# Altium project Carte_IPAv.PrjPcb
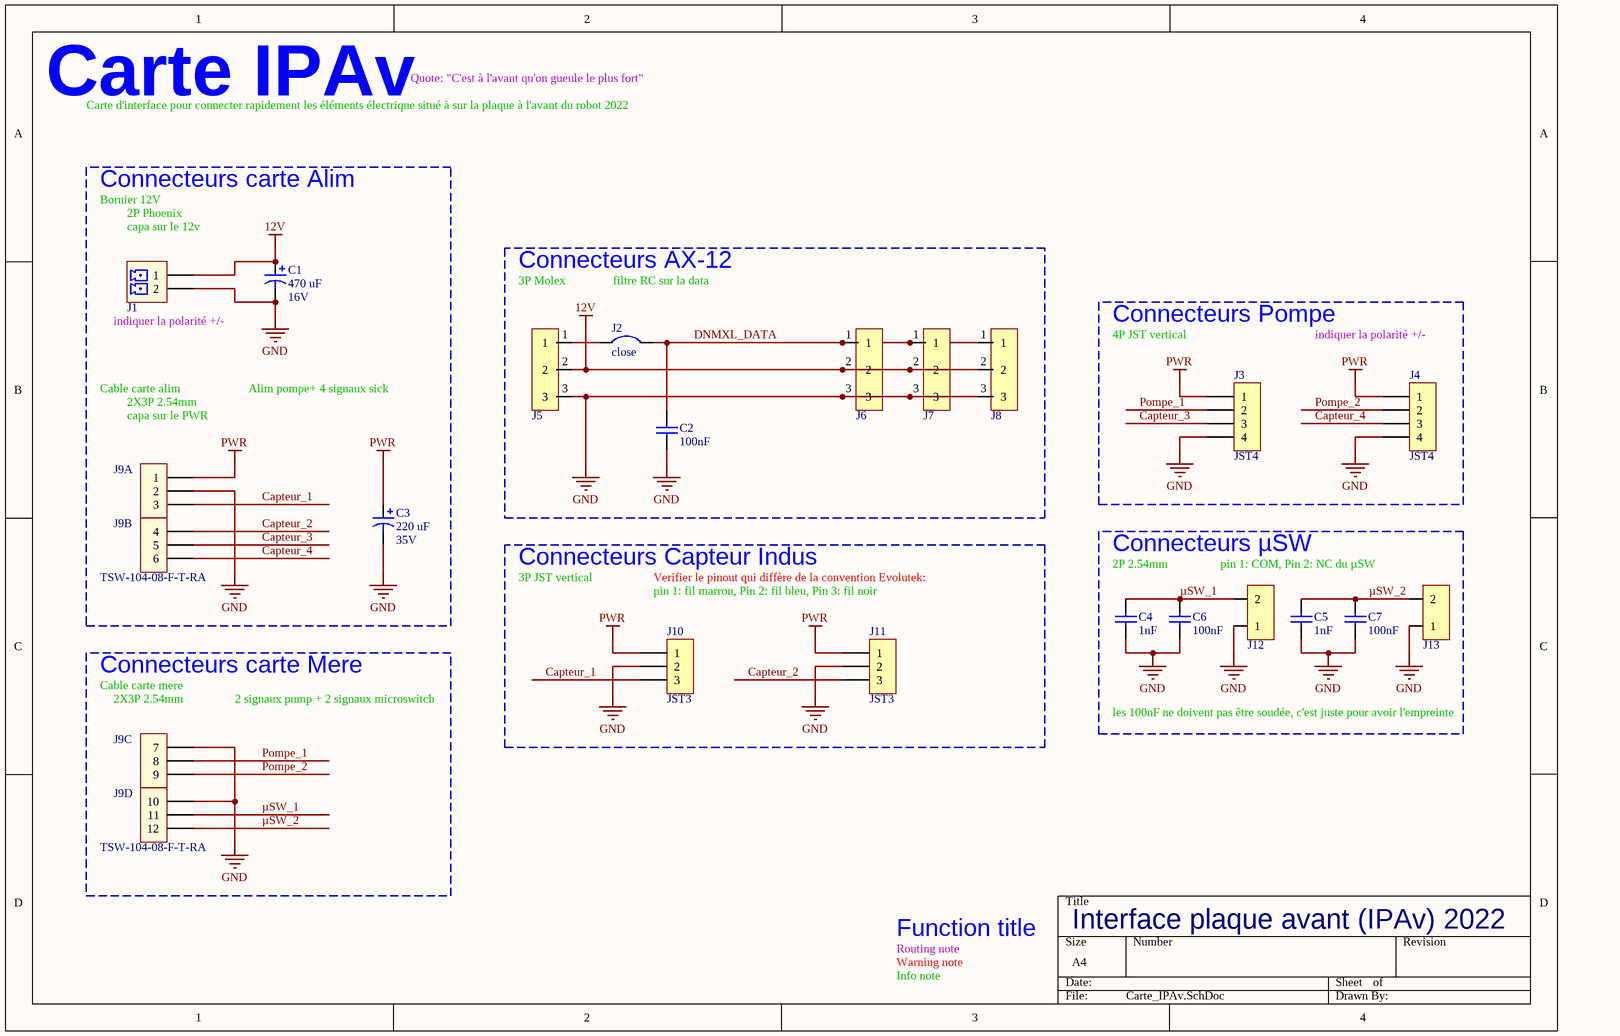
[diagram p0: Carte_IPAv.SchDoc]
1 sheet, 20 parts. Net scope: global (net labels, ports and power ports of the same name join across sheets).
Board file: Carte_IPAv.PcbDoc

## Sheet Carte_IPAv.SchDoc
size A4; Author: Audran; CompanyName: Goldorak; Address1: Electrolab; Address2: 52 rue Paul Lescop; Address3: 92000 Nanterre; DocumentNumber: 1; SheetNumber: 1; SheetTotal: 5; ProjectName: Cartes_2017

### Parts
C1  470 uF  RatedVoltage: 16V  [WCAP-ATG8_8x11.5x3.5x0.5]
C2  100nF  [WCAP-CSGP_0603, 1.6x0.8x0.8]
C3  220 uF  RatedVoltage: 35V  [WCAP-ATG8_8x11.5x3.5x0.5]
C4  1nF  [WCAP-CSGP_0402, 1x0.5x0.5]
C5  1nF  [WCAP-CSGP_0402, 1x0.5x0.5]
C6  100nF  [WCAP-CSGP_0603, 1.6x0.8x0.8]
C7  100nF  [WCAP-CSGP_0603, 1.6x0.8x0.8]
J1  691322110002  [691322110002]  (value not drawn)
J2  close  [CAVALIER_0603_C]  (net tie, no BOM)
J3  JST4  [JST4]
J4  JST4  [JST4]
J5  22-03-5035  [20-03-5035]  (value not drawn)
J6  22-03-5035  [20-03-5035]  (value not drawn)
J7  22-03-5035  [20-03-5035]  (value not drawn)
J8  22-03-5035  [20-03-5035]  (value not drawn)
J9  TSW-104-08-F-T-RA  [TSW-104-08-F-T-RA]  (value not drawn)  (parts A,B,C,D of 4)
J10  JST3  [JST3]
J11  JST3  [JST3]
J12  22-03-2021  [22-03-2021]  (value not drawn)
J13  22-03-2021  [22-03-2021]  (value not drawn)

### Blocks framed on the sheet
Connecteurs carte Alim: C1 C3 J1 J9
Connecteurs AX-12: C2 J2 J5-J8
Connecteurs Pompe: J3 J4
Connecteurs Capteur Indus: J10 J11
Connecteurs µSW: C4-C7 J12 J13
Connecteurs carte Mere: J9

### Nets
12V: C1.1 J1.1 J5.2 J6.2 J7.2 J8.2
GND: C1.2 C2.2 C3.2 C4.2 C5.2 C6.2 C7.2 J1.2 J3.4 J4.4 J5.3 J6.3 J7.3 J8.3 J9.2 J9.7 J9.10 J10.2 J11.2 J12.1 J13.1
PWR: C3.1 J3.1 J4.1 J9.1 J10.1 J11.1
Capteur_1: J9.3 J10.3
Capteur_2: J9.4 J11.3
Capteur_3: J3.3 J9.5
Capteur_4: J4.3 J9.6
DNMXL_DATA: C2.1 J2.2 J6.1 J7.1 J8.1
Pompe_1: J3.2 J9.8
Pompe_2: J4.2 J9.9
µSW_1: C4.1 C6.1 J9.11 J12.2
µSW_2: C5.1 C7.1 J9.12 J13.2
NetJ2_1: J2.1 J5.1

### Notes on the sheet
- Carte IPAv
- Carte d'interface pour connecter rapidement les éléments électrique situé à sur la plaque à l'avant du robot 2022
- Quote: "C'est à l'avant qu'on gueule le plus fort"
- Bornier 12V
- 2P Phoenix
- (near J1) capa sur le 12v
- 3P Molex
- filtre RC sur la data
- indiquer la polarité +/-
- 4P JST vertical
- Cable carte alim
- capa sur le PWR
- 2X3P 2.54mm
- Alim pompe+ 4 signaux sick
- 3P JST vertical
- Verifier le pinout qui diffère de la convention Evolutek:
- 2P 2.54mm
- pin 1: COM, Pin 2: NC du µSW
- pin 1: fil marron, Pin 2: fil bleu, Pin 3: fil noir
- Cable carte mere
- (near J9) 2X3P 2.54mm
- 2 signaux pump + 2 signaux microswitch
- les 100nF ne doivent pas être soudée, c'est juste pour avoir l'empreinte
- Routing note
- Warning note
- Info note
- Function title
- Interface plaque avant (IPAv) 2022

### Library data of the parts
C1 = WCAP-ATG8, 860010374012: CAP Alu 470 UF 20% 16 V; Manufacturer: Wurth Elektronik; ComponentLink1Description: Datasheet; ComponentLink1URL: http://katalog.we-online.de/pbs/datasheet/860010374012.pdf; Manufacturer Part Number: 860010374012; Value: 470 uF; Size: 8mmx11.5mm
C2 C6 C7 = WCAP-CSGP, 885012206095: CAP CER 100nF 50V X7R 0603; Manufacturer: Wurth Elektronik; ComponentLink1Description: Datasheet; ComponentLink1URL: http://katalog.we-online.com/pbs/datasheet/885012206095.pdf; Manufacturer Part Number: 885012206095; Value: 100nF; Size: 0603; CeramicType: X7R; Supplier 2: JLCPCB; Supplier Part Number 2: C14663; RatedVoltage: 50V; Supplier Footprint 2: 0603; Supplier 1: Farnell; Supplier Part Number 1: 2495187
C3 = WCAP-ATG8, 860010574011: CAP Alu 220 UF 20% 35 V; Manufacturer: Wurth Elektronik; ComponentLink1Description: Datasheet; ComponentLink1URL: http://katalog.we-online.de/pbs/datasheet/860010574011.pdf; Manufacturer Part Number: 860010574011; Value: 220 uF; Size: 8mmx11.5mm
C4 C5 = WCAP-CSGP, 885012205061: CAP CER 1nF 50V X7R 0402; Manufacturer: Wurth Elektronik; ComponentLink1Description: Datasheet; ComponentLink1URL: http://katalog.we-online.com/pbs/datasheet/885012205061.pdf; Manufacturer Part Number: 885012205061; Value: 1nF; Size: 0402; CeramicType: X7R; RatedVoltage: 50V; Supplier 2: JLCPCB; Supplier Part Number 2: C1523; Supplier Footprint 2: 0402
J1 = 691322110002: WR-TBL 2p Series 3221 - 3.50 mm Horizontal PCB Header; Manufacturer: Wurth Electronics Inc.; Value: 2; Supplier 1: Farnell; Manufacturer Part Number: 691322110002; Supplier Part Number 1: 1841315; ComponentLink1Description: Datasheet; ComponentLink1URL: http://katalog.we-online.de/em/datasheet/6913221100xx.pdf
J2 = CAVALIER_0603_C: Cavalier soudure "fermé" + empreinte dipole 0603
J5-J8 = 20-03-5035: CONN HEADER VERT 3POS 2.5MM; Manufacturer: MOLEX; Supplier 1: Farnell; Supplier Part Number 1: 9979620; Manufacturer Part Number: 22-03-5035; ComponentLink1URL: http://www.farnell.com/datasheets/1801024.pdf; ComponentLink1Description: Datasheet; ComponentLink2URL: http://www.farnell.com/cad/495071.pdf  http://www.farnell.com/cad/1533907.pdf  http://www.farnell.com/cad/1533907.pdf; ComponentLink2Description: Drawings
J9 = TSW-104-08-F-T-RA: CONN HEADER R/A 3L x 4POS 2.54MM; Manufacturer: SAMTEC; Manufacturer Part Number: TSW-104-08-F-T-RA; Supplier 1: Farnell; Supplier Part Number 1: 2053041; ComponentLink1Description: Datasheet; ComponentLink1URL: http://cloud.samtec.com/catalog_english/TSW_TH.PDF
J12 J13 = 22-03-2021: CONN HEADER VERT 2POS 2.54MM; Manufacturer: MOLEX; Supplier 1: Farnell; Supplier Part Number 1: 9731075; Manufacturer Part Number: 22-03-2021; ComponentLink1URL: http://www.farnell.com/datasheets/1791308.pdf; ComponentLink1Description: Datasheet; ComponentLink2URL: http://www.farnell.com/cad/495071.pdf  http://www.farnell.com/cad/1533907.pdf  http://www.farnell.com/cad/1533907.pdf; ComponentLink2Description: Drawings

## Assembly variants
PROD: not fitted C2 C4 C5 C6 C7 J1 J2 J2 J3